# EAGLE design HTVC8038_4LayerBoard_v2 (EAGLE 7.4.0)
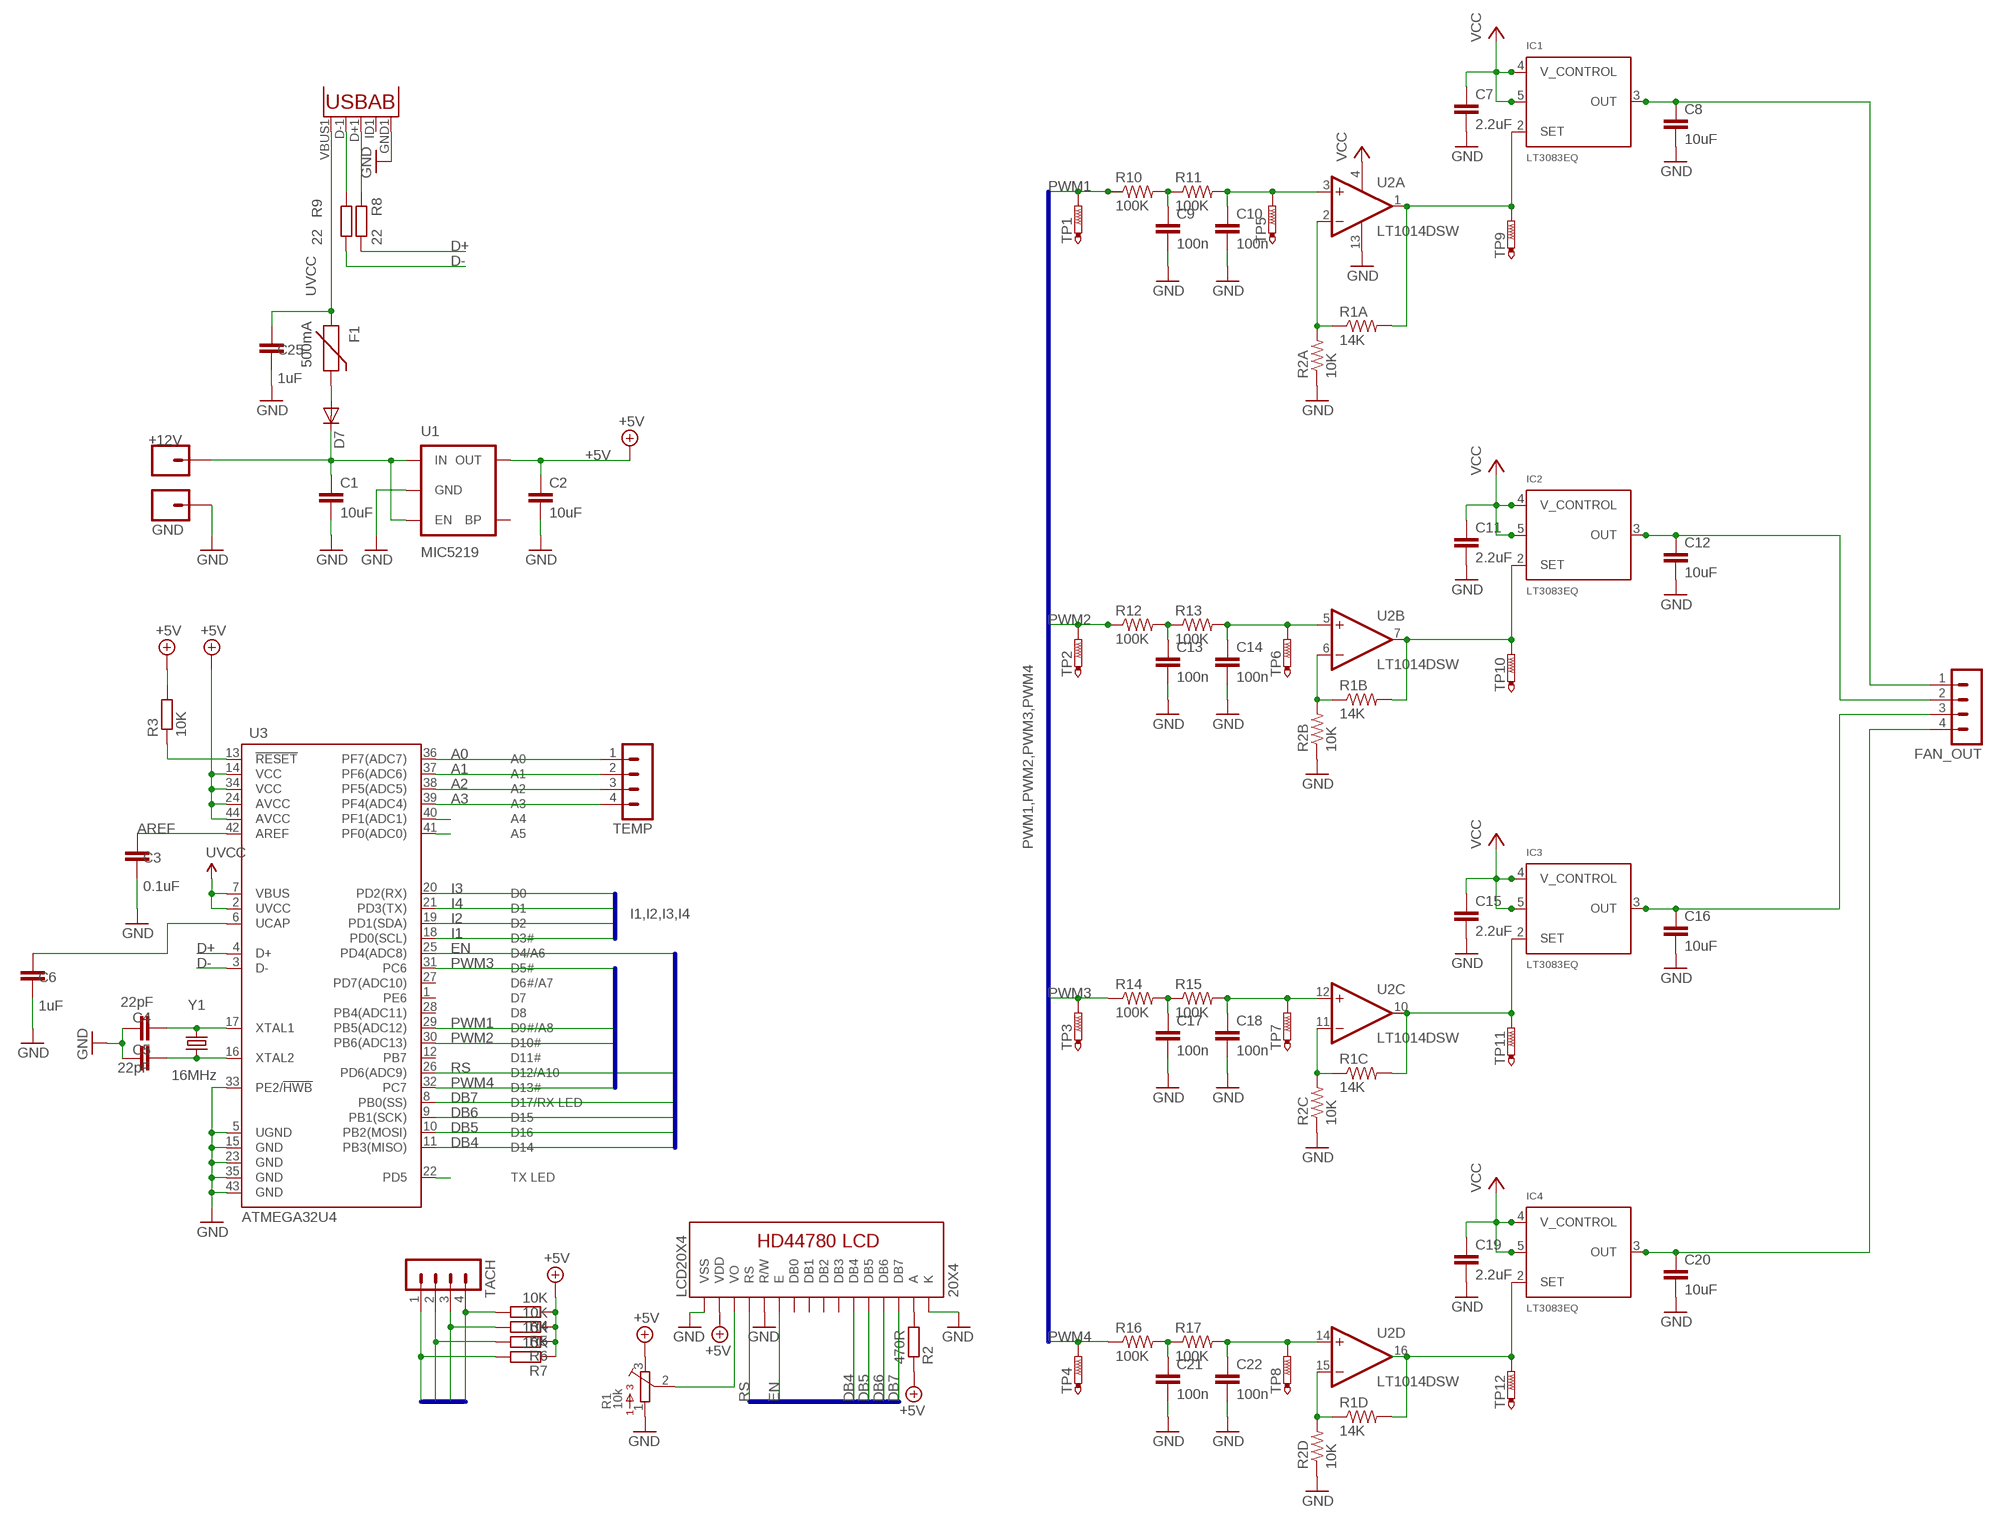
[diagram p0: schematic, sheet 1]

## Parts
+12V  +12V  M01PTH  [1X01]
C1  10uF  C-EUC1206  [C1206]
C2  10uF  C-EUC1206  [C1206]
C3  0.1uF  C-EUC0805  [C0805]
C4  22pF  C-EUC0805  [C0805]
C5  22pF  C-EUC0805  [C0805]
C6  1uF  C-EUC0805  [C0805]
C7  2.2uF  C-EUC0805  [C0805]
C8  10uF  C-EUC1206  [C1206]
C9  100n  C-EUC0805  [C0805]
C10  100n  C-EUC0805  [C0805]
C11  2.2uF  C-EUC0805  [C0805]
C12  10uF  C-EUC1206  [C1206]
C13  100n  C-EUC0805  [C0805]
C14  100n  C-EUC0805  [C0805]
C15  2.2uF  C-EUC0805  [C0805]
C16  10uF  C-EUC1206  [C1206]
C17  100n  C-EUC0805  [C0805]
C18  100n  C-EUC0805  [C0805]
C19  2.2uF  C-EUC0805  [C0805]
C20  10uF  C-EUC1206  [C1206]
C21  100n  C-EUC0805  [C0805]
C22  100n  C-EUC0805  [C0805]
C25  1uF  C-EUC0805  [C0805]
D7  DIODESOD  [SOD-323]
F1  500mA  PTCSMD  [PTC-1206]
FAN_OUT  MA04-1  [MA04-1]
GND  GND  M01PTH  [1X01]
IC1  LT3083EQ  [DDPAK_TO263-5]
IC2  LT3083EQ  [DDPAK_TO263-5]
IC3  LT3083EQ  [DDPAK_TO263-5]
IC4  LT3083EQ  [DDPAK_TO263-5]
LCD20X4  20X4  LCD-HD447804-HOLES20X4-4HOLES  [LCD-20X4-4HOLES]
R1  10k  3362P  [3362P]
R1A  14K  R-US_R0603  [R0603]
R1B  14K  R-US_R0603  [R0603]
R1C  14K  R-US_R0603  [R0603]
R1D  14K  R-US_R0603  [R0603]
R2  470R  R-EU_R0805  [R0805]
R2A  10K  R-US_R0805  [R0805]
R2B  10K  R-US_R0805  [R0805]
R2C  10K  R-US_R0805  [R0805]
R2D  10K  R-US_R0805  [R0805]
R3  10K  R-EU_R0805  [R0805]
R4  10K  R-EU_R0805  [R0805]
R5  10K  R-EU_R0805  [R0805]
R6  10K  R-EU_R0805  [R0805]
R7  10K  R-EU_R0805  [R0805]
R8  22  R-EU_R0805  [R0805]
R9  22  R-EU_R0805  [R0805]
R10  100K  R-US_R0805  [R0805]
R11  100K  R-US_R0805  [R0805]
R12  100K  R-US_R0805  [R0805]
R13  100K  R-US_R0805  [R0805]
R14  100K  R-US_R0805  [R0805]
R15  100K  R-US_R0805  [R0805]
R16  100K  R-US_R0805  [R0805]
R17  100K  R-US_R0805  [R0805]
TACH  MA04-1  [MA04-1]
TEMP  MA04-1  [MA04-1]
TP1  PTR1B2,54  [B2,54]
TP2  PTR1B2,54  [B2,54]
TP3  PTR1B2,54  [B2,54]
TP4  PTR1B2,54  [B2,54]
TP5  PTR1B2,54  [B2,54]
TP6  PTR1B2,54  [B2,54]
TP7  PTR1B2,54  [B2,54]
TP8  PTR1B2,54  [B2,54]
TP9  PTR1B2,54  [B2,54]
TP10  PTR1B2,54  [B2,54]
TP11  PTR1B2,54  [B2,54]
TP12  PTR1B2,54  [B2,54]
U1  MIC5219  V_REG_LDOSMD  [SOT23-5]
U2  LT1014DSW  [SO16W]
U3  ATMEGA32U4  ATMEGA32U4TQFP  [SPARKFUN-DIGITALIC_TQFP44]
X1  USB-ABIN&OUT  [USB-AB-MICRO-SMD-V03-IN&OUT]
Y1  16MHz  CRYSTAL5X3  [CRYSTAL-SMD-5X3]

## Nets
+5V: C2.1 LCD20X4.P$2(VDD) R1.3 R2.1 R3.2 R4.1 R5.1 R6.1 R7.1 U1.5(OUT) U3.14(VCC) U3.24(AVCC) U3.34(VCC) U3.44(AVCC)
A0: TEMP.1 U3.36(PF7(ADC7))
A1: TEMP.2 U3.37(PF6(ADC6))
A2: TEMP.3 U3.38(PF5(ADC5))
A3: TEMP.4 U3.39(PF4(ADC4))
A4: U3.40(PF1(ADC1))
A5: U3.41(PF0(ADC0))
AREF: C3.2 U3.42(AREF)
D+: R8.1 U3.4(D+)
D-: R9.1 U3.3(D-)
DB4: LCD20X4.P$11(DB4) U3.11(PB3(MISO))
DB5: LCD20X4.P$12(DB5) U3.10(PB2(MOSI))
DB6: LCD20X4.P$13(DB6) U3.9(PB1(SCK))
DB7: LCD20X4.P$14(DB7) U3.8(PB0(SS))
EN: LCD20X4.P$6(E) U3.25(PD4(ADC8))
GND: C1.2 C2.2 C3.1 C4.2 C5.2 C6.1 C7.2 C8.2 C9.2 C10.2 C11.2 C12.2 C13.2 C14.2 C15.2 C16.2 C17.2 C18.2 C19.2 C20.2 C21.2 C22.2 C25.1 GND.1 LCD20X4.P$1(VSS) LCD20X4.P$5(R/W) LCD20X4.P$16(K) R1.1 R2A.1 R2B.1 R2C.1 R2D.1 U1.2(GND) U2.13(P:V-) U3.5(UGND) U3.15(GND) U3.23(GND) U3.33(PE2/!HWB) U3.35(GND) U3.43(GND) X1.GND1(GND)
I1: R7.2 TACH.1 U3.18(PD0(SCL))
I2: R6.2 TACH.2 U3.19(PD1(SDA))
I3: R5.2 TACH.3 U3.20(PD2(RX))
I4: R4.2 TACH.4 U3.21(PD3(TX))
N$1: R1A.1 R2A.2 U2.2(A:-IN)
N$2: R1B.1 R2B.2 U2.6(B:-IN)
N$3: R1C.1 R2C.2 U2.11(C:-IN)
N$4: R1D.1 R2D.2 U2.15(D:-IN)
N$5: C9.1 R10.2 R11.1
N$6: C13.1 R12.2 R13.1
N$7: LCD20X4.P$3(VO) R1.2
N$8: LCD20X4.P$15(A) R2.2
N$9: C5.1 U3.16(XTAL2) Y1.1
N$10: C4.1 U3.17(XTAL1) Y1.3
N$11: D7.2(A) F1.2
N$12: C6.2 U3.6(UCAP)
N$13: R9.2 X1.D-1(D-)
N$14: R8.2 X1.D+1(D+)
N$15: C17.1 R14.2 R15.1
N$16: C21.1 R16.2 R17.1
OPAMP1: C10.1 R11.2 TP5.TP U2.3(A:+IN)
OPAMP2: C14.1 R13.2 TP6.TP U2.5(B:+IN)
OPAMP3: C18.1 R15.2 TP7.TP U2.12(C:+IN)
OPAMP4: C22.1 R17.2 TP8.TP U2.14(D:+IN)
OUT1: C8.1 FAN_OUT.1 IC1.3(OUT) IC1.6(OUT)
OUT2: C12.1 FAN_OUT.2 IC2.3(OUT) IC2.6(OUT)
OUT3: C16.1 FAN_OUT.3 IC3.3(OUT) IC3.6(OUT)
OUT4: C20.1 FAN_OUT.4 IC4.3(OUT) IC4.6(OUT)
PWM1: R10.1 TP1.TP U3.29(PB5(ADC12))
PWM2: R12.1 TP2.TP U3.30(PB6(ADC13))
PWM3: R14.1 TP3.TP U3.31(PC6)
PWM4: R16.1 TP4.TP U3.32(PC7)
RESET: R3.1 U3.13(!RESET)
RS: LCD20X4.P$4(RS) U3.26(PD6(ADC9))
SET1: IC1.2(SET) R1A.2 TP9.TP U2.1(A:OUT)
SET2: IC2.2(SET) R1B.2 TP10.TP U2.7(B:OUT)
SET3: IC3.2(SET) R1C.2 TP11.TP U2.10(C:OUT)
SET4: IC4.2(SET) R1D.2 TP12.TP U2.16(D:OUT)
TXLED: U3.22(PD5)
UVCC: C25.2 F1.1 U3.2(UVCC) U3.7(VBUS) X1.VBUS1(VBUS)
VCC: +12V.1 C1.1 C7.1 C11.1 C15.1 C19.1 D7.1(C) IC1.4(V_CONTROL) IC1.5(IN) IC2.4(V_CONTROL) IC2.5(IN) IC3.4(V_CONTROL) IC3.5(IN) IC4.4(V_CONTROL) IC4.5(IN) U1.1(IN) U1.3(EN) U2.4(P:V+)
Unconnected: LCD20X4.P$7(DB0) LCD20X4.P$8(DB1) LCD20X4.P$9(DB2) LCD20X4.P$10(DB3) U1.4(BP) U3.1(PE6) U3.12(PB7) U3.27(PD7(ADC10)) U3.28(PB4(ADC11)) X1.ID1(USBID)

## Buses
RS,EN,DB4,DB5,DB6,DB7
PWM1,PWM2,PWM3,PWM4
I1,I2,I3,I4

## Library data of the parts
+12V GND = SparkFun-Connectors:M01: Header 1 Standard 1-pin 0.1" header. Use with straight break away headers (SKU : PRT-00116), right angle break away headers (PRT-00553), swiss pins (PRT-00743), machine pins (PRT-00117), and female headers (PRT-00115).
C1-C8 C11 C12 C15 C16 C19 C20 C25 = rcl:C-EU: CAPACITOR, European symbol
C9 C10 C13 C14 C17 C18 C21 C22 = resistor:C-EU: CAPACITOR, European symbol
D7 = SparkFun:DIODE: Diode These are standard reverse protection diodes and small signal diodes. SMA package can handle up to about 1A. SOD-323 can handle about 200mA. What the SOD-323 package when ordering, there are some mfgs out there that are 5-pin packages.
F1 = SparkFun:PTC: Resettable Fuse PTC Resettable Fuse. Spark Fun Electronics SKU : COM-08357
FAN_OUT TACH TEMP = con-lstb:MA04-1: PIN HEADER; OC_FARNELL: unknown; OC_NEWARK: unknown
IC1-IC4 = nervus:LT3083
LCD20X4 = HD44780LCD-2:LCD-HD44780
R1 = nervus:3362: 3362 Series 1/4" Square Trimmer
R1A R1B R1C R1D = rcl:R-US_: RESISTOR, American symbol
R2-R9 = rcl:R-EU_: RESISTOR, European symbol
R2A R2B R2C R2D R10-R17 = resistor:R-US_: RESISTOR, American symbol
TP1-TP12 = testpad:PTR1: TEST PIN
U1 = SparkFun:V_REG_LDO: Voltage Regulator LDO Standard 150mA LDO voltage regulator in SOT-23 layout. Micrel part MIC5205. BP (by-pass) pin is used to lower output noise with 470pF cap.
U2 = nervus:LT1014: Quad Precision Op AmpDatasheet <http://cds.linear.com/docs/en/datasheet/10134fd.pdf>
U3 = SparkFun-Retired:ATMEGA32U4: Atmel 44-pin 8-bit Microcontroller with 32KBytes of ISP Flash and USB Controller ----- Please use the QFN-44-NOPAD_1:1 package for the footprint of all boards using a 32U4. Route traces directly away from the pads as much as possible.; PROD_ID: IC-11161
X1 = Testing:USB-AB: This is a USB AB connector that is compatible with USB OTG. i.e. this connector can serve as a host or device
Y1 = SparkFun:CRYSTAL: Crystals Various standard crystals. Proven footprints. Spark Fun Electronics SKU : COM-00534

## Net classes
0 default: width 0.203 mm
1 VCC: width 0.813 mm, drill 0.406 mm, clearance 0.406 mm
2 GND: width 0.813 mm, drill 0.406 mm, clearance 0.406 mm

## Board
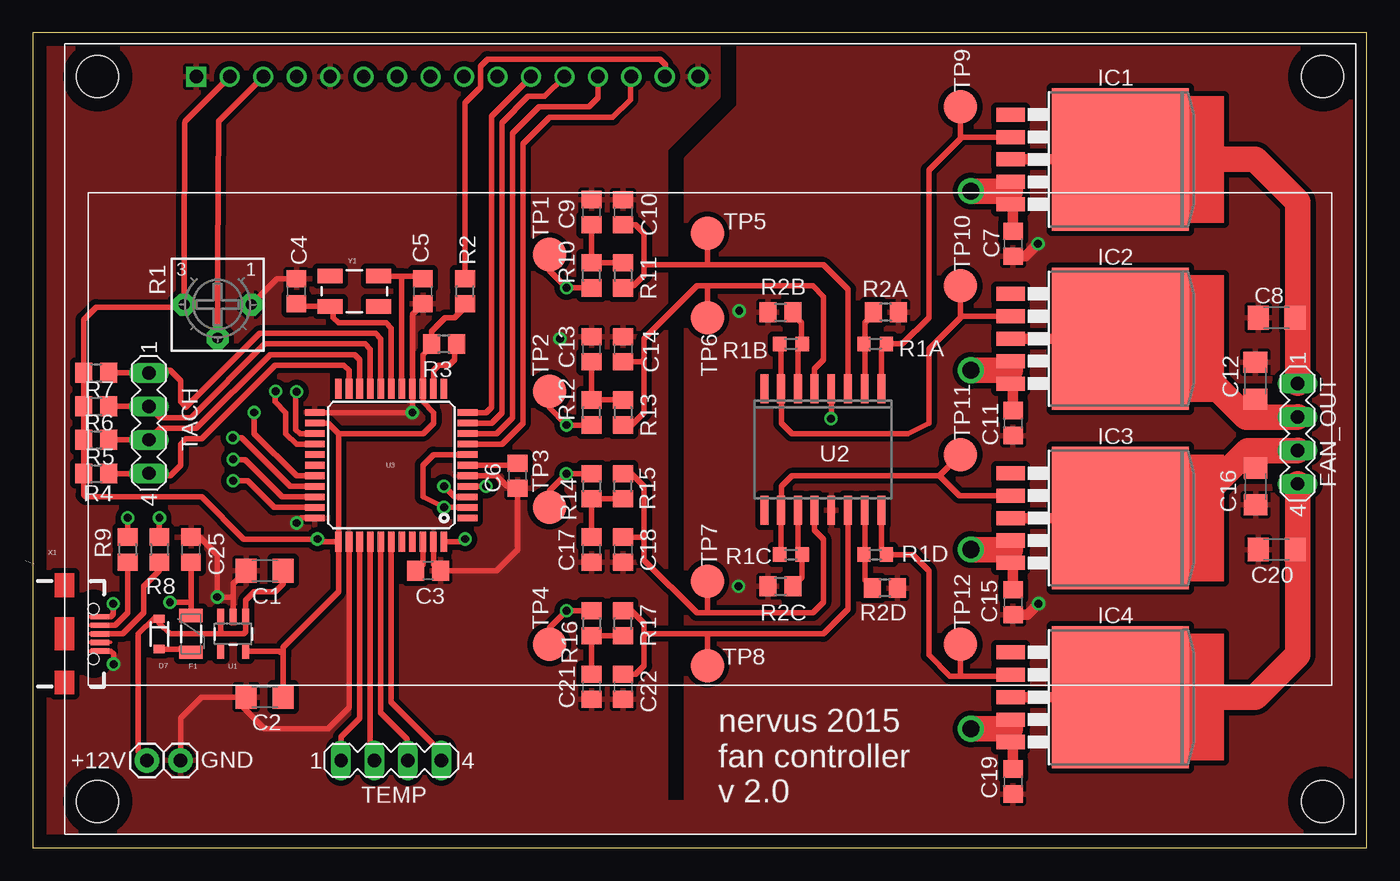
[diagram p1: board, top side]
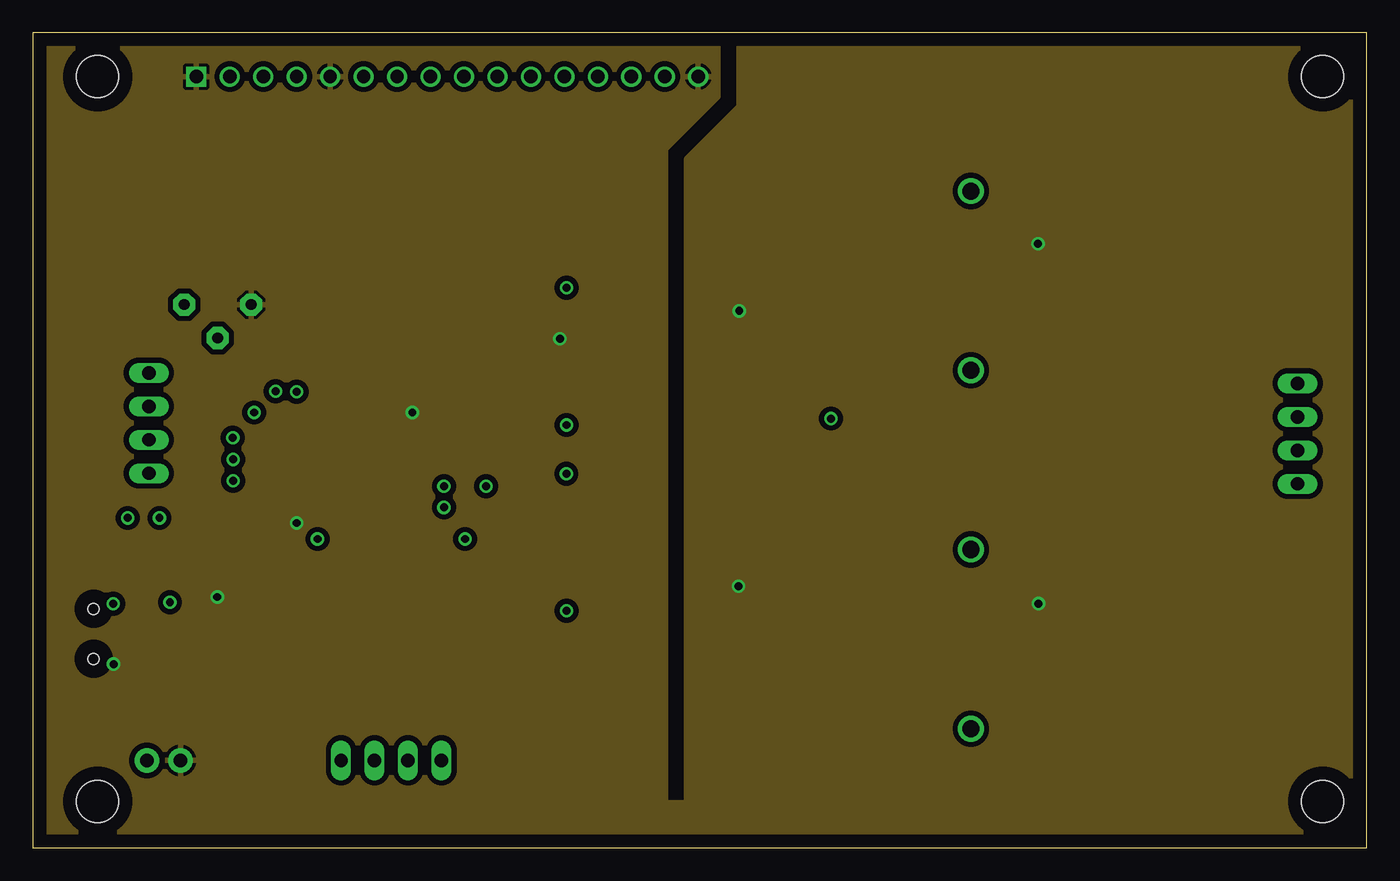
[diagram p2: board, inner layer GND]
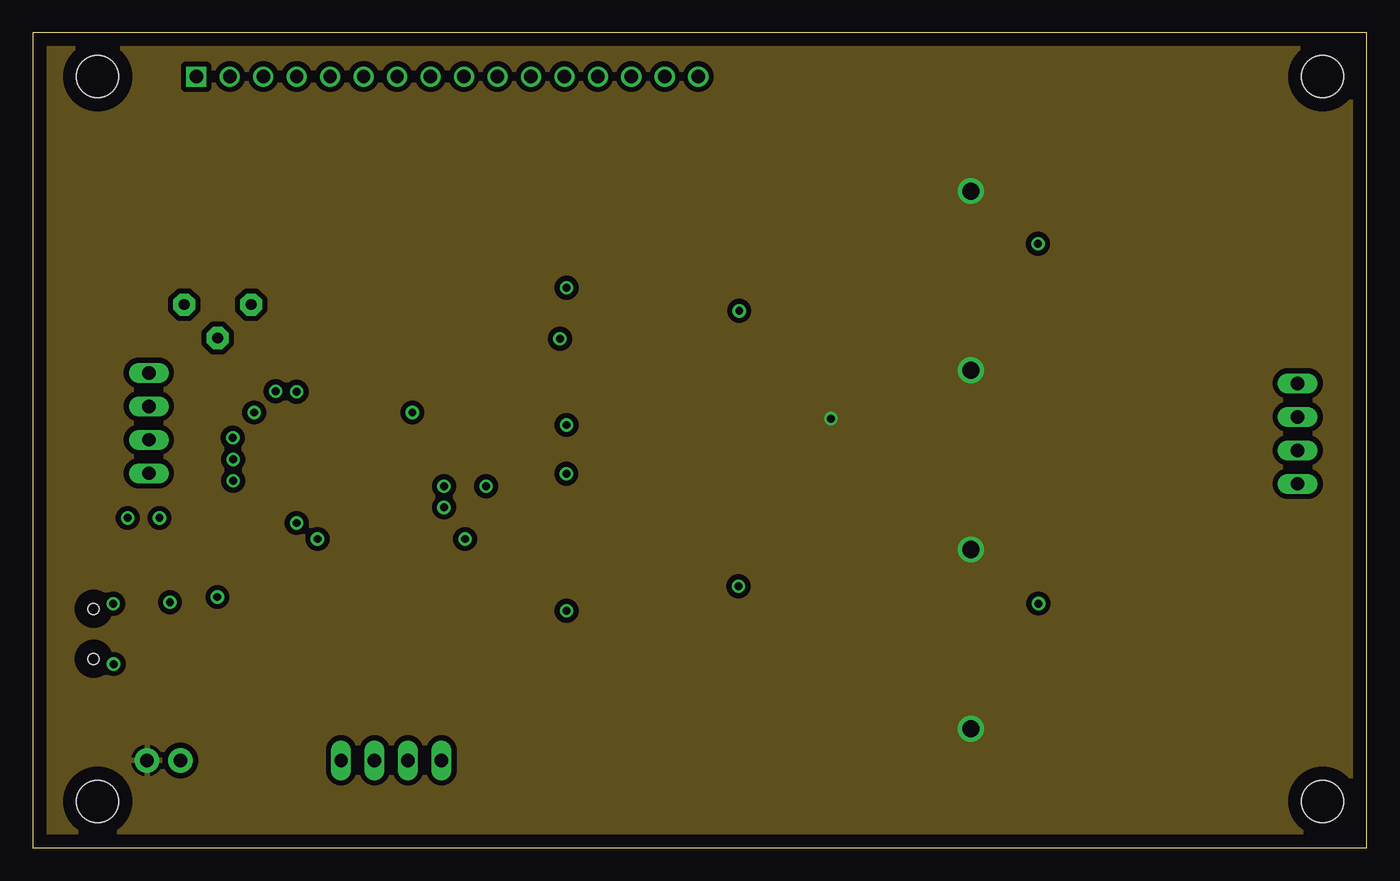
[diagram p3: board, inner layer VCC]
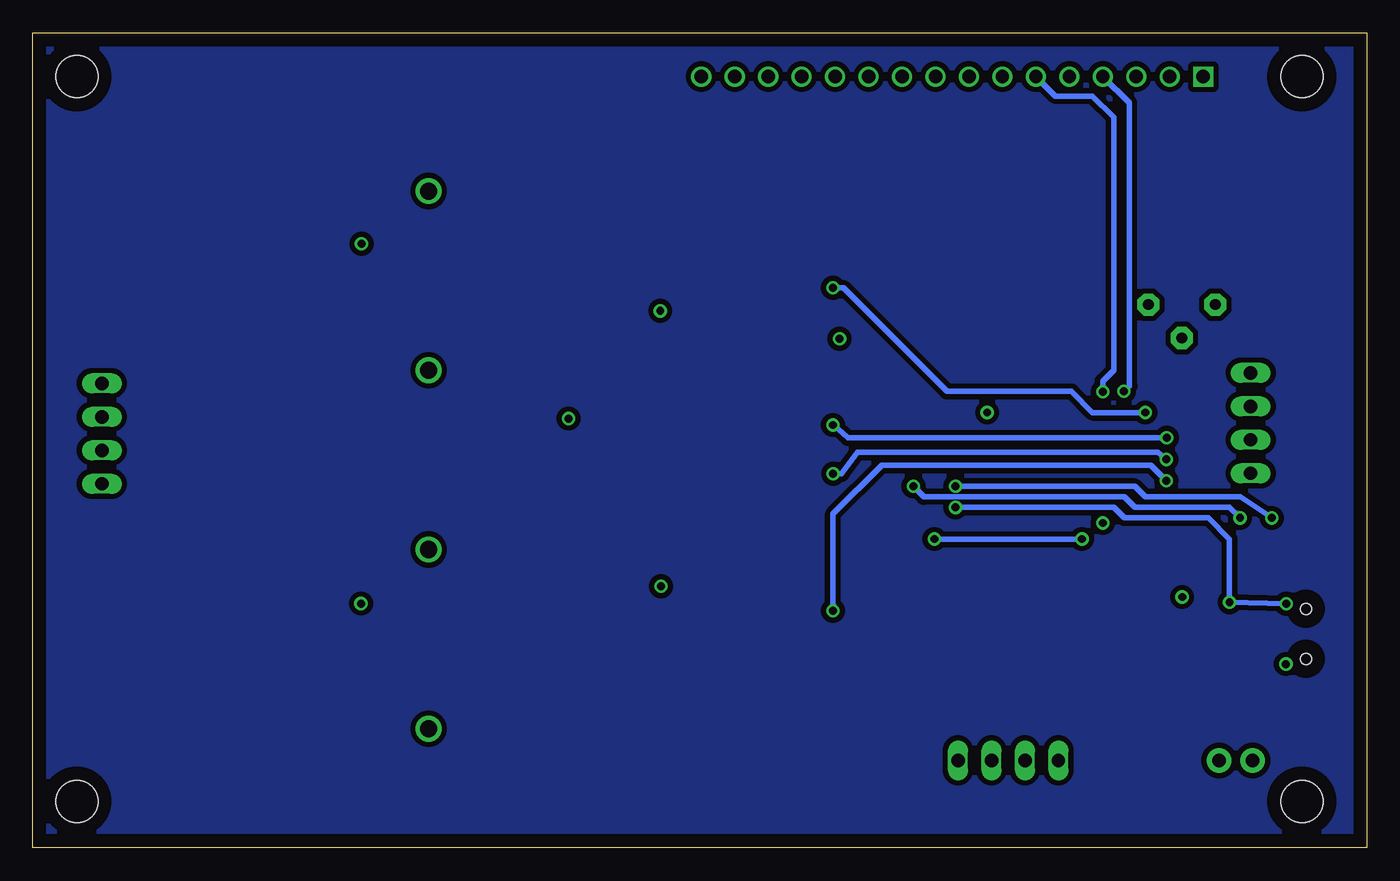
[diagram p4: board, bottom side, seen from below]

Size 101.23 x 61.82 mm. Coordinates in mm from the lower left corner, seen from the top.
Outline: 0,0 101.23,0 101.23,61.82 0,61.82 0,0
Copper layers (1*2*15*16): Top 0.035mm / dielectric 1.5mm / GND 0.035mm / dielectric 0.15mm / VCC 0.035mm / dielectric 0.2mm / Bottom 0.035mm
Design rules "default *": minimum track width 10mil, minimum drill 24mil, track to track 0.4mm, track to pad 0.4mm, pad to pad 0.4mm, via to via 0.4mm, smd to smd 0.4mm, copper to edge 40mil, drill to drill 8mil, minimum pad ring 10mil, minimum via ring 8mil, stop-mask expansion 4mil, vias tented up to drill 0mil, thermal gap 10mil

### Footprints (pad centres in the part's own frame; a part is rotated, then mirrored left to right if it is on the bottom)
1X01 = drill 1.016 pad 1.88: 1 0,0
C1206 = smd 1.6 x 1.8: 1 -1.4,0; 2 1.4,0
C0805 = smd 1.3 x 1.5: 1 -0.95,0; 2 0.95,0
SOD-323 = smd 0.63 x 0.83: 1 -1.15,0; 2 1.15,0
PTC-1206 = smd 1 x 1.8: 1 -1.4,0; 2 1.4,0
MA04-1 = drill 1.016 long: 1 -3.81,0; 2 -1.27,0; 3 1.27,0; 4 3.81,0
DDPAK_TO263-5 = smd 1.067 x 2.159: 1 -3.404,-5.791; 2 -1.702,-5.791; 3 0,-5.791; 4 1.702,-5.791; 5 3.404,-5.791 | smd 10.8 x 10.41: 6 0,2.54
LCD-20X4-4HOLES = drill 1.016 square: P$1 10,57.5 | drill 1.016: P$2 12.54,57.5; P$3 15.08,57.5; P$4 17.62,57.5; P$5 20.16,57.5; P$6 22.7,57.5; P$7 25.24,57.5; P$8 27.78,57.5; P$9 30.32,57.5; P$10 32.86,57.5; P$11 35.4,57.5; P$12 37.94,57.5; P$13 40.48,57.5; P$14 43.02,57.5; P$15 45.56,57.5; P$16 48.1,57.5 | hole 3.2: 2.5,2.5; 2.5,57.5; 95.5,57.5; 95.5,2.5
3362P = drill 0.813 pad 1.676 octagon: 1 -2.54,0; 2 0,2.54; 3 2.54,0
R0603 = smd 1 x 1.1: 1 -0.85,0; 2 0.85,0
R0805 = smd 1.3 x 1.5: 1 -0.95,0; 2 0.95,0
B2,54 = smd 2.54 x 2.54: TP 0,0
SOT23-5 = smd 0.55 x 1.2: 1 -0.95,-1.3; 2 0,-1.3; 3 0.95,-1.3; 4 0.95,1.3; 5 -0.95,1.3
SO16W = smd 0.6 x 2.2: 1 -4.445,-4.6; 2 -3.175,-4.6; 3 -1.905,-4.6; 4 -0.635,-4.6; 5 0.635,-4.6; 6 1.905,-4.6; 7 3.175,-4.6; 8 4.445,-4.6; 9 4.445,4.6; 10 3.175,4.6; 11 1.905,4.6; 12 0.635,4.6; 13 -0.635,4.6; 14 -1.905,4.6; 15 -3.175,4.6; 16 -4.445,4.6
SPARKFUN-DIGITALIC_TQFP44 = smd 1.5 x 0.5: 1 -5.8,4; 2 -5.8,3.2; 3 -5.8,2.4; 4 -5.8,1.6; 5 -5.8,0.8; 6 -5.8,0; 7 -5.8,-0.8; 8 -5.8,-1.6; 9 -5.8,-2.4; 10 -5.8,-3.2; 11 -5.8,-4; 23 5.8,-4; 24 5.8,-3.2; 25 5.8,-2.4; 26 5.8,-1.6; 27 5.8,-0.8; 28 5.8,0; 29 5.8,0.8; 30 5.8,1.6; 31 5.8,2.4; 32 5.8,3.2; 33 5.8,4 | smd 0.5 x 1.5: 12 -4,-5.8; 13 -3.2,-5.8; 14 -2.4,-5.8; 15 -1.6,-5.8; 16 -0.8,-5.8; 17 0,-5.8; 18 0.8,-5.8; 19 1.6,-5.8; 20 2.4,-5.8; 21 3.2,-5.8; 22 4,-5.8; 34 4,5.8; 35 3.2,5.8; 36 2.4,5.8; 37 1.6,5.8; 38 0.8,5.8; 39 0,5.8; 40 -0.8,5.8; 41 -1.6,5.8; 42 -2.4,5.8; 43 -3.2,5.8; 44 -4,5.8
USB-AB-MICRO-SMD-V03-IN&OUT = smd 1.4 x 0.4: D+1 2.7,0; D-1 2.7,0.65; GND1 2.7,-1.3; ID1 2.7,-0.65; VBUS1 2.7,1.3 | hole 0.85: 2.2,1.9; 2.2,-1.9
CRYSTAL-SMD-5X3 = smd 1.9 x 1.1: 1 -1.85,-1.15; 2 1.85,-1.15; 3 1.85,1.15; 4 -1.85,1.15

### Placement (x,y rotation side)
+12V  8.66,6.62 0 top
C1  17.6,21.02 180 top
C2  17.6,11.43 180 top
C3  30,21.02 180 top
C4  20,42.22 90 top
C5  29.6,42.22 270 top
C6  36.79,28.22 90 top
C7  74.4,45.82 270 top
C8  94.4,40.21 180 top
C9  42.4,48.23 90 top
C10  44.8,48.22 90 top
C11  74.4,32.22 270 top
C12  92.79,35.42 90 top
C13  42.4,37.82 90 top
C14  44.8,37.82 90 top
C15  74.4,18.62 270 top
C16  92.81,27.41 270 top
C17  42.4,22.62 270 top
C18  44.8,22.62 270 top
C19  74.4,5.02 270 top
C20  94.41,22.62 180 top
C21  42.4,12.22 270 top
C22  44.8,12.22 270 top
C25  12,22.62 270 top
D7  9.6,16.22 270 top
F1  12,16.22 270 top
FAN_OUT  96,31.42 270 top
GND  11.2,6.62 0 top
IC1  80,52.22 270 top
IC2  80,38.62 270 top
IC3  80,25.01 270 top
IC4  80,11.42 270 top
LCD20X4  2.4,1.01 0 top
R1  14.02,41.21 180 top
R1A  63.94,38.23 0 top
R1B  57.54,38.23 180 top
R1C  57.54,22.23 180 top
R1D  63.94,22.23 0 top
R2  32.8,42.22 90 top
R2A  64.74,40.63 180 top
R2B  56.74,40.63 0 top
R2C  56.74,19.83 0 top
R2D  64.67,19.7 180 top
R3  31.2,38.22 180 top
R4  4.8,28.39 0 top
R5  4.8,30.96 0 top
R6  4.8,33.5 0 top
R7  4.8,36.04 0 top
R8  9.6,22.62 270 top
R9  7.2,22.62 270 top
R10  42.4,43.42 90 top
R11  44.8,43.42 270 top
R12  42.4,33.02 90 top
R13  44.8,33.02 270 top
R14  42.4,27.42 270 top
R15  44.8,27.42 90 top
R16  42.4,17.02 270 top
R17  44.8,17.02 90 top
TACH  8.8,32.22 270 top
TEMP  27.2,6.62 0 top
TP1  39.21,45.01 0 top
TP2  39.2,34.62 0 top
TP3  39.2,25.82 0 top
TP4  39.2,15.42 0 top
TP5  51.2,46.62 0 top
TP6  51.2,40.22 0 top
TP7  51.2,20.22 0 top
TP8  51.2,13.82 0 top
TP9  70.4,56.22 0 top
TP10  70.4,42.62 0 top
TP11  70.4,29.82 0 top
TP12  70.4,15.42 0 top
U1  15.2,16.22 180 top
U2  59.96,30.22 180 top
U3  27.2,29.02 180 top
X1  2.4,16.22 0 top
Y1  24.4,42.22 180 top

### Tracks (layer width: path | path; a pad name or v marks a point on that pad's centre or on a via)
+5V  (via drill 0.6)
  Top 0.406: U3.34 23.2,31.42 | 23.2,31.42 22.4,32.22 U3.24 | 14.94,58.46 LCD20X4.P$2 11.56,55.13 11.51,54.94 11.48,44.65 R1.3 11.29,41.02 4.8,41.02 3.85,40.07 R7.1 R6.1 R5.1 | 23.2,31.42 29.6,31.42 30.4,32.22 30.4,33.02 29.6,33.82 U3.14 29.6,37.42 30.4,38.22 30.4,37.67 R3.2 30.27,38.24 30.27,39.2 31.29,40.22 32,40.22 32.8,41.02 R2.1 | C2.1 19,14.62 | 19,14.62 19,15.22 23.2,19.42 U3.34 | U1.5 18.7,14.92 19,14.62 | R4.1 R5.1 | R5.1 3.85,26.77 4,26.62 12.8,26.62 16,23.42 v21.6,23.42 21.8,23.22 U3.34 | U3.44 32.6,23.22 v32.8,23.42
  Bottom 0.406: v32.8,23.42 v21.6,23.42
A0
  Top 0.406: TEMP.1 23.39,8.41 24.8,9.82 U3.36
A1
  Top 0.406: U3.37 25.6,6.95 TEMP.2
A2
  Top 0.406: U3.38 26.4,10.22 28.4,8.22 28.4,6.69 TEMP.3
A3
  Top 0.406: TEMP.4 31.01,7.21 27.2,11.02 U3.39
AREF
  Top 0.406: U3.42 29.6,21.47 C3.2
D+  (via drill 0.6)
  Top 0.406: R8.1 v9.6,25.02 | U3.4 v34.4,27.42
  Bottom 0.406: v9.6,25.02 10.4,25.82 17.6,25.82 18.4,26.62 33.6,26.62 v34.4,27.42
D-  (via drill 0.6)
  Top 0.406: R9.1 v7.2,25.02 | v31.2,27.42 32,26.62 U3.3
  Bottom 0.406: v7.2,25.02 9.6,26.62 16.8,26.62 17.6,27.42 v31.2,27.42
DB4
  Top 0.406: U3.11 34.4,33.02 34.8,33.42 34.8,55.51 LCD20X4.P$11
DB5
  Top 0.406: U3.10 34.8,32.22 35.6,33.02 35.6,55.02 37.6,57.02 38.85,57.02 LCD20X4.P$12
DB6
  Top 0.406: U3.9 35.2,31.42 36.4,32.62 36.4,54.22 38.4,56.22 42.2,56.22 42.88,56.9 LCD20X4.P$13
DB7
  Top 0.406: U3.8 35.6,30.62 37.2,32.22 37.2,53.42 39.2,55.42 44,55.42 45.35,56.77 45.35,58.44 LCD20X4.P$14
EN  (via drill 0.6)
  Top 0.406: U3.25 20.27,31.42 19.96,31.73 19.96,34.53 v20.02,34.59
  Bottom 0.406: v20.02,34.59 20.02,35.4 19.2,36.22 19.2,55.42 20.8,57.02 23.61,57.02 LCD20X4.P$6
GND  (via drill 0.6)
  Top 0.406: 30.64,20.65 C3.1 | U1.2 15.2,19.02 | 15.2,19.02 15.2,20.02 C1.2 | 15.2,19.02 v14,19.02 14,22.22 12.4,23.82 12.25,23.82 C25.1 | GND.1 11.2,9.82 12.8,11.42 C2.2 16,11.23 16,10.62 17.6,9.02 22.4,9.02 24,10.62 U3.35 | U3.43 30.4,21.47 C3.1 | U3.23 v28.8,33.02 U3.15 28.8,40.47 C5.2 | R1.1 18.52,43.17 C4.2 | C3.1 35.2,21.02 36.79,22.61 36.79,23.43 | 5.9,14.92 6.12,14.7 v6.12,13.93 | U3.5 35.2,28.22 36,27.42 36.64,27.42 C6.1 36.79,23.43 | 36.79,23.43 36.8,23.42 | U3.33 20.4,25.02 v20.01,24.63
  Top 0.813: C15.2 75.48,17.67 v76.33,18.52 | C7.2 75.33,44.87 v76.29,45.83
  other vias: 53.55,19.83 53.61,40.73 40,38.62
  pour GND: 0,61.82 51.2,61.82 52,61.02 52,57.02 48,53.02 48,3.42 49.6,3.42 49.6,52.22 53.6,56.22 53.6,61.02 54.4,61.82 101.6,61.82 101.6,0.22 0,0.22
  pour Top (isolate 0.406): 0,61.82 51.2,61.82 52,61.02 52,57.02 48,53.02 48,3.42 49.6,3.42 49.6,52.22 53.6,56.22 53.6,61.02 54.4,61.82 101.6,61.82 101.6,0.22 0,0.22
I1
  Top 0.406: U3.18 26.4,38.62 26,39.02 17.2,39.02 11.6,33.42 11.2,33.82 11.2,35.42 10.4,36.22 8.99,36.22 TACH.1 R7.2
I2
  Top 0.406: U3.19 25.6,37.82 25.2,38.22 17.6,38.22 12,32.62 9.67,32.62 TACH.2 R6.2
I3
  Top 0.406: U3.20 24.8,37.02 24.4,37.42 18,37.42 12.4,31.82 9.67,31.82 TACH.3 R5.2
I4
  Top 0.406: U3.21 24,36.22 23.6,36.62 18.4,36.62 12.8,31.02 11.6,31.02 11.2,30.62 11.2,29.02 10.4,28.22 8.99,28.22 TACH.4 8.78,28.39 R4.2
N$1
  Top 0.406: U2.2 63.13,38.18 R1A.1 63.14,38.28 63.14,39.83 63.79,40.48 R2A.2
N$2
  Top 0.406: U2.6 58.05,37.9 R1B.1 58.34,38.28 58.34,39.83 57.69,40.48 R2B.2
N$3
  Top 0.406: U2.11 58.05,22.56 R1C.1 58.39,20.53 R2C.2
N$4
  Top 0.406: U2.15 63.13,22.27 | 63.13,22.27 R1D.1 | 63.13,22.27 63.13,20.29 R2D.2
N$5
  Top 0.406: R11.1 R10.2 C9.1
N$6
  Top 0.406: C13.1 R12.2 R13.1
N$7
  Top 0.406: R1.2 14.02,44.65 14.08,55.08 14.08,55.11 LCD20X4.P$3 17.48,58.48
N$8
  Top 0.406: R2.2 32.8,56.53 33.96,57.69 33.96,59.29 34.5,59.83 47.59,59.83 48,59.42 48,58.55 LCD20X4.P$15
N$9
  Top 0.406: 26,43.02 26.25,43.27 Y1.1 28,43.37 | U3.16 28,43.37 | 28,43.37 29.4,43.37 C5.1
N$10
  Top 0.406: U3.17 27.2,39.42 26.8,39.82 23.2,39.82 22.8,40.22 22.8,40.82 Y1.3 20.2,41.07 C4.1
N$11
  Top 0.406: D7.2 11.75,15.07 F1.2
N$12
  Top 0.406: U3.6 36.64,29.02 C6.2
N$13
  Top 0.406: 5.9,16.87 6.25,16.87 7.2,17.82 R9.2
N$14
  Top 0.406: 5.9,16.22 6.8,16.22 8.4,17.82 8.4,19.82 9.6,21.02 R8.2
N$15
  Top 0.406: C17.1 R14.2 R15.1
N$16
  Top 0.406: C21.1 R16.2 R17.1
N$17
  pour Bottom: 0,61.82 0,0.22 101.6,0.22 101.6,61.82
OPAMP1
  Top 0.406: R11.2 44.95,42.62 45.6,42.62 46.4,43.42 46.4,44.22 | C10.1 45.75,47.27 46.4,46.62 46.4,44.22 | U2.3 61.87,42.35 60,44.22 51.2,44.22 | 51.2,44.22 46.4,44.22 | TP5.TP 51.2,44.22
OPAMP2
  Top 0.406: R13.2 45.45,32.07 46.4,33.02 46.4,37.02 | 46.4,37.02 46.4,38.62 50.4,42.62 51.2,42.62 | 51.2,42.62 59.2,42.62 60,41.82 60,37.02 59.33,36.35 U2.5 | C14.1 46.25,36.87 46.4,37.02 | TP6.TP 51.2,42.62
OPAMP3
  Top 0.406: R15.2 45.45,28.37 46.4,27.42 46.4,23.42 | 46.4,23.42 46.4,21.82 50.4,17.82 51.2,17.82 | 51.2,17.82 59.2,17.82 60,18.62 60,23.42 59.33,24.09 U2.12 | C18.1 46.25,23.57 46.4,23.42 | TP7.TP 51.2,17.82
OPAMP4
  Top 0.406: C22.1 45.75,13.17 46.4,13.82 46.4,16.22 | U2.14 61.87,18.09 60,16.22 51.2,16.22 | 51.2,16.22 46.4,16.22 | R17.2 45.45,17.97 46.4,17.02 46.4,16.22 | TP8.TP 51.2,16.22
OUT1
  Top 0.406: C8.1 95.99,40.21 96,40.22
  Top 0.813: IC1.3 IC1.6 83.2,52.22
  Top 1.93: 83.2,52.22 92.8,52.22 96,49.02 96,40.22 FAN_OUT.1
OUT2
  Top 0.406: C12.1 92.79,32.66 92.8,32.65
  Top 0.813: IC2.3 IC2.6 83.2,38.62
  Top 1.93: 83.2,38.62 86.12,38.62 92.09,32.65 92.8,32.65 95.96,32.65 FAN_OUT.2
OUT3
  Top 0.406: C16.1 92.81,30.11 92.8,30.12
  Top 0.813: IC3.3 IC3.6
  Top 1.93: IC3.6 87.1,25.01 92.21,30.12 92.8,30.12 95.97,30.12 FAN_OUT.3
OUT4
  Top 0.406: C20.1 96,22.62
  Top 0.813: IC4.3 IC4.6
  Top 1.93: IC4.6 92.8,11.42 96,14.62 96,22.62 FAN_OUT.4
PWM1  (via drill 0.6)
  Top 0.406: U3.29 20,28.22 16.8,31.42 v16.8,33.02 | R10.1 41.66,42.47 v40.5,42.48 39.21,43.77 TP1.TP
  Bottom 0.406: v40.5,42.48 39.72,42.47 31.87,34.62 22.4,34.62 20.8,33.02 v16.8,33.02
PWM2  (via drill 0.6)
  Top 0.406: U3.30 19.52,27.42 15.84,31.1 v15.17,31.1 | R12.1 v40.5,32.07 39.2,33.37 TP2.TP
  Bottom 0.406: v40.5,32.07 40.41,32.07 39.38,31.1 v15.17,31.1
PWM3  (via drill 0.6)
  Top 0.406: U3.31 18.93,26.62 16.11,29.44 15.21,29.44 v15.19,29.46 | R14.1 v40.49,28.37 39.2,27.08 TP3.TP
  Bottom 0.406: v40.49,28.37 39.85,28.37 38.65,30.02 15.84,30 v15.19,29.46
PWM4  (via drill 0.6)
  Top 0.406: U3.32 18.3,25.82 16.29,27.83 v15.21,27.83 v15.2,27.84 | R16.1 v40.5,17.97 39.2,16.67 TP4.TP
  Bottom 0.406: v40.5,17.97 40.5,25.32 36.8,29.02 16.38,29.02 v15.2,27.84
RESET
  Top 0.406: U3.13 30.4,36.22 30.8,36.62 31.6,36.62 32,37.02 32,37.67 R3.1
RS  (via drill 0.6)
  Top 0.406: U3.26 20,30.62 19.2,31.42 19.2,33.02 18.4,33.82 18.4,34.62 v18.42,34.64
  Bottom 0.406: v18.42,34.64 18,35.03 18.02,56.5 18.02,56.51 LCD20X4.P$4
SET1
  Top 0.406: U2.1 64.41,37.85 R1A.2 66.01,38.23 68,40.22 68,51.42 70.5,53.92 | IC1.2 70.5,53.92 | TP9.TP 70.4,54.02 70.5,53.92
SET2
  Top 0.406: U2.7 56.79,35.42 | 56.79,35.42 56.79,38.13 R1B.2 | IC2.2 70.5,40.32 | 70.5,40.32 68,37.82 68,32.22 66.4,31.42 57.6,31.42 56.8,32.22 56.8,35.4 56.79,35.42 | TP10.TP 70.4,40.42 70.5,40.32
SET3
  Top 0.406: R1C.2 56.79,22.33 U2.10 56.8,25.63 56.8,27.42 57.6,28.22 68.8,28.22 | IC3.2 70.31,26.71 68.8,28.22 | TP11.TP 68.8,28.22
SET4
  Top 0.406: U2.16 64.41,22.62 R1D.2 66.79,22.23 68,21.02 68,14.62 69.6,13.02 70.4,13.02 | 70.4,13.02 74.11,13.02 IC4.2 | TP12.TP 70.4,13.02
UVCC  (via drill 0.6)
  Top 0.406: F1.1 12,18.62 | 12,18.62 C25.2 | v10.4,18.62 12,18.62 | U3.2 v31.2,25.82 29.6,26.62 29.6,29.02 30.4,29.82 U3.7 | 5.9,17.52 6.09,17.7 v6.09,18.51
  Bottom 0.406: v6.09,18.51 v10.4,18.62 10.4,23.42 12,25.02 18.4,25.02 19.2,25.82 v31.2,25.82
VCC  (via drill 0.6, 1.3)
  Top 0.406: U2.4 60.59,32.57 v60.58,32.56 | 14.4,16.22 10.4,16.22 9.6,17.02 D7.1 9.55,17.42 9.2,17.42 8,16.22 8,7.28 +12V.1 | 14.4,16.22 16,16.22 16.15,16.37 U1.1 16.15,18.77 16.8,19.42 18.4,19.42 19,20.02 C1.1 | U1.3 14.25,16.37 14.4,16.22
  Top 0.813: C19.1 74.4,7.83 IC4.5 74.21,9.02 IC4.4 | C15.1 74.4,21.41 IC3.5 74.21,22.62 IC3.4 | C11.1 74.4,35.02 IC2.5 74.21,36.22 IC2.4 | C7.1 74.4,48.63 IC1.5 74.21,49.82 IC1.4
  Top 1.93: v71.2,9.02 74.21,9.02 | v71.2,22.62 74.21,22.62 | v71.2,36.22 74.21,36.22 | v71.2,49.82 74.21,49.82
  pour VCC: 0,61.82 101.6,61.82 101.6,0.22 0,0.22
(copper drawn outside any net)
  shapes: Top area x5

### Text on the board
tNames: nervus 2015 / fan controller / v 2.0